# Altium schematic sheet EMG sensors.SchDoc
size 297 x 209 mm
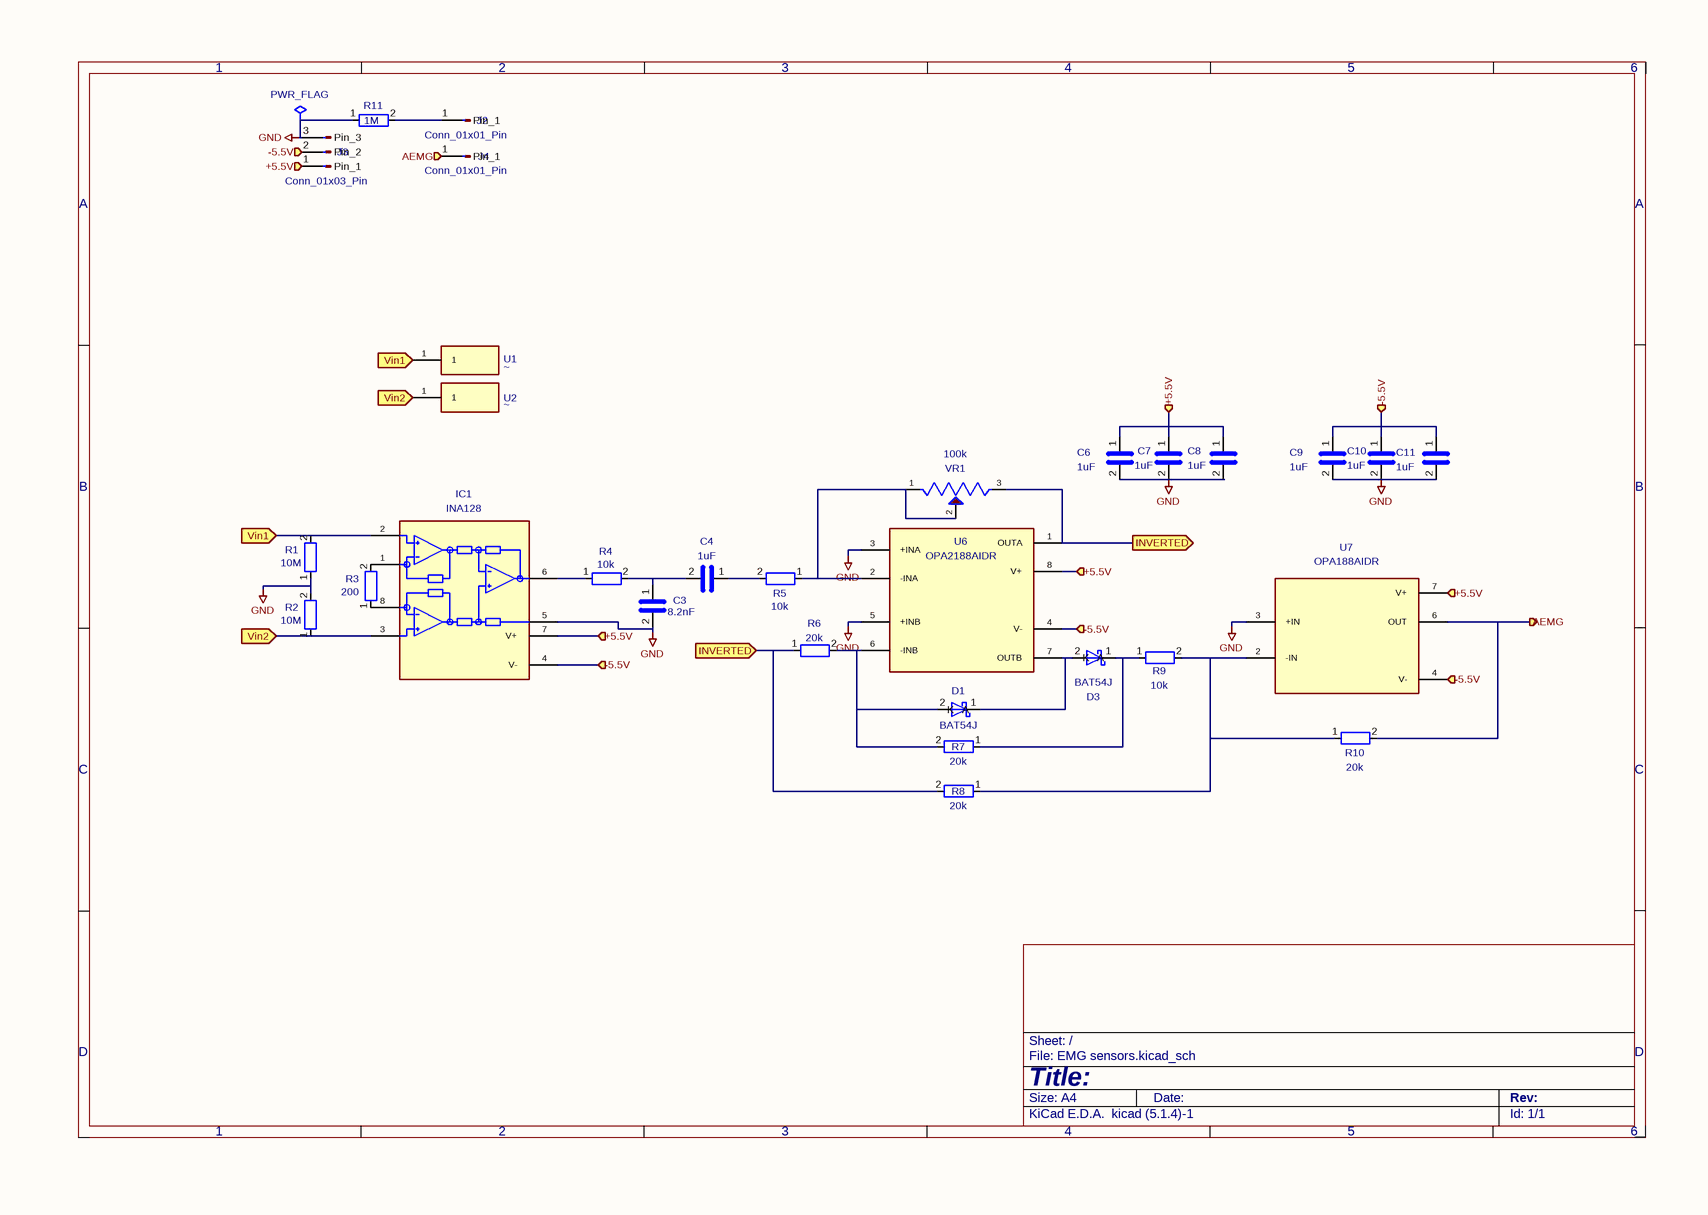
[diagram p0: EMG sensors.SchDoc]

## Parts
#FLG01  PWR_FLAG  (graphical)
C3  8.2nF  [C_0603_1608Metric_Pad1.08x0.95mm_HandSolder]
C4  1uF  [C_0603_1608Metric_Pad1.08x0.95mm_HandSolder]
C6  1uF  [C_0603_1608Metric_Pad1.08x0.95mm_HandSolder]
C7  1uF  [C_0603_1608Metric_Pad1.08x0.95mm_HandSolder]
C8  1uF  [C_0603_1608Metric_Pad1.08x0.95mm_HandSolder]
C9  1uF  [C_0603_1608Metric_Pad1.08x0.95mm_HandSolder]
C10  1uF  [C_0603_1608Metric_Pad1.08x0.95mm_HandSolder]
C11  1uF  [C_0603_1608Metric_Pad1.08x0.95mm_HandSolder]
D1  BAT54J  [D_SOD-323F]
D3  BAT54J  [D_SOD-323F]
IC1  INA128  [INA128U]
J2  Conn_01x01_Pin  [DIN_Male_1PIN_1.5mm]
J3  Conn_01x03_Pin  [JST_GH_SM03B-GHS-TB_1x03-1MP_P1.25mm_Horizontal]
J4  Conn_01x01_Pin  [DIN_Male_1PIN_1.5mm]
R1  10M  [R_0603_1608Metric_Pad0.98x0.95mm_HandSolder]
R2  10M  [R_0603_1608Metric_Pad0.98x0.95mm_HandSolder]
R3  200  [R_0603_1608Metric_Pad0.98x0.95mm_HandSolder]
R4  10k  [R_0603_1608Metric_Pad0.98x0.95mm_HandSolder]
R5  10k  [R_0603_1608Metric_Pad0.98x0.95mm_HandSolder]
R6  20k  [R_0603_1608Metric_Pad0.98x0.95mm_HandSolder]
R7  20k  [R_0603_1608Metric_Pad0.98x0.95mm_HandSolder]
R8  20k  [R_0603_1608Metric_Pad0.98x0.95mm_HandSolder]
R9  10k  [R_0603_1608Metric_Pad0.98x0.95mm_HandSolder]
R10  20k  [R_0603_1608Metric_Pad0.98x0.95mm_HandSolder]
R11  1M  [R_0603_1608Metric_Pad0.98x0.95mm_HandSolder]
U1  ~  [EMG_Snap_4mm]
U2  ~  [EMG_Snap_4mm]
U6  OPA2188AIDR  [ОПА2188AIDR]
U7  OPA188AIDR  [OPA188]
VR1  100k  [TRIM_3296W-1-104ALF]

## Ports
+5.5V (in), +5.5V (out), -5.5V (in), -5.5V (out), AEMG (in), AEMG (out), INVERTED (in), INVERTED (out), Vin1 (in), Vin1 (out), Vin2 (in), Vin2 (out)

## Nets
GND: #FLG01.1 C3.2 C6.2 C7.2 C8.2 C9.2 C10.2 C11.2 IC1.5 J3.3(Pin_3) R1.1 R2.2 R11.1 U6.3(+INA) U6.5(+INB) U7.3(+IN)
+5.5V: C6.1 C7.1 C8.1 IC1.7(V+) J3.1(Pin_1) U6.8(V+) U7.7(V+) ; port +5.5V
-5.5V: C9.1 C10.1 C11.1 IC1.4(V-) J3.2(Pin_2) U6.4(V-) U7.4(V-) ; port -5.5V
AEMG: J4.1(Pin_1) R10.2 U7.6(OUT) ; port AEMG
INVERTED: R6.1 R8.2 U6.1(OUTA) VR1.3 ; port INVERTED
Vin1: IC1.2 R1.2 U1.1 ; port Vin1
Vin2: IC1.3 R2.1 U2.1 ; port Vin2
NetC3_1: C3.1 C4.2 R4.2
NetC4_1: C4.1 R5.2
NetD1_1: D1.1(K) D3.2(A) U6.7(OUTB)
NetD1_2: D1.2(A) R6.2 R7.2 U6.6(-INB)
NetD3_1: D3.1(K) R7.1 R9.1
NetIC1_1: IC1.1 R3.2
NetIC1_6: IC1.6 R4.1
NetIC1_8: IC1.8 R3.1
NetJ2_1: J2.1(Pin_1) R11.2
NetR5_1: R5.1 U6.2(-INA) VR1.1 VR1.2
NetR8_1: R8.1 R9.2 R10.1 U7.2(-IN)

## Notes on the sheet
- 1
- 2
- 3
- 4
- 5
- 6
- A
- B
- C
- D
- Title:
- File: EMG sensors.kicad_sch
- Sheet: /
- KiCad E.D.A.  kicad (5.1.4)-1
- Size: A4
- Date:
- Rev:
- Id: 1/1

## Library data of the parts
#FLG01 = PWR_FLAG: Description: Special symbol for telling ERC where power comes from; Value: PWR_FLAG
C3 C4 C6-C11 = C: Description: Unpolarized capacitor; Footprint: Capacitor_SMD:C_0603_1608Metric_Pad1.08x0.95mm_HandSolder
  C3: Website: https://eu.mouser.com/ProductDetail/KEMET/C0603X822F5JACTU?qs=rKqJIm0tnYHyDiSLXoAHvg%3D%3D; Value: 8.2nF
  C4 C6-C11: Website: https://www.digikey.in/en/products/detail/kyocera-avx/KGM15BR71H104JT/1600043; Value: 1uF
D1 D3 = BAT54J: Description: 30V 200mA Schottky diode, SOD-323F; Value: BAT54J; Footprint: Diode_SMD:D_SOD-323F
IC1 = INA128: MF: Texas Instruments; Description_1: \n                        \n                            Instrumentation Amplifier 1 Circuit - 8-PDIP\n                        \n; Package: DIP-8 Rochester Electronics, LLC; MPN: INA128U; Price: None; OC_FARNELL: 1212413; SnapEDA_Link: https://www.snapeda.com/parts/INA128/Texas+Instruments/view-part/?ref=snap; MP: INA128; OC_NEWARK: 35C1729; Availability: Not in stock; Check_prices: https://www.snapeda.com/parts/INA128/Texas+Instruments/view-part/?ref=eda; Value: INA128; Footprint: OP AMPS:INA128U
J2 J4 = Conn_01x01_Pin: Description: Generic connector, single row, 01x01, script generated; Value: Conn_01x01_Pin; Footprint: Connectors:DIN_Male_1PIN_1.5mm
J3 = Conn_01x03_Pin: Description: Generic connector, single row, 01x03, script generated; Value: Conn_01x03_Pin; Footprint: Connector_JST:JST_GH_SM03B-GHS-TB_1x03-1MP_P1.25mm_Horizontal
R1-R11 = R: Description: Resistor; Footprint: Resistor_SMD:R_0603_1608Metric_Pad0.98x0.95mm_HandSolder
  R1 R2: Website: https://eu.mouser.com/ProductDetail/TE-Connectivity-Holsworthy/RT73F1J200RBTD?qs=sGAEpiMZZMvdGkrng054txLI%2FDB4oIKDBdRkx0ZmGeiYIoSkg5JMIw%3D%3D; Value: 10M
  R3: Website: https://eu.mouser.com/ProductDetail/TE-Connectivity-Holsworthy/RT73F1J200RBTD?qs=sGAEpiMZZMvdGkrng054txLI%2FDB4oIKDBdRkx0ZmGeiYIoSkg5JMIw%3D%3D; Value: 200
  R4 R5 R9: Value: 10k
  R6-R8 R10: Value: 20k
  R11: Value: 1M
U1 U2 = H_1: Value: ~; Footprint: EMG:EMG_Snap_4mm
U6 = OPA2188AIDR: MF: Texas Instruments; Description_1: \n                        \n                            0.03µV/°C, 6µV Vos, Low Noise, Rail-to-Rail Output, 36V Zero-Drift Operational Amplifier\n                        \n; Package: SOIC-8 Texas Instruments; Price: None; SnapEDA_Link: https://www.snapeda.com/parts/OPA2188AIDR/Texas+Instruments/view-part/?ref=snap; MP: OPA2188AIDR; Availability: In Stock; Check_prices: https://www.snapeda.com/parts/OPA2188AIDR/Texas+Instruments/view-part/?ref=eda; Value: OPA2188AIDR; Footprint: OP AMPS:ОПА2188AIDR
U7 = OPA188AIDR: MF: Texas Instruments; Description_1: \n                        \n                            Precision, Low-Noise, Rail-to-Rail Output, 36V Zero-Drift Operational Amplifier\n                        \n; Package: SOIC-8 Texas Instruments; Price: None; SnapEDA_Link: https://www.snapeda.com/parts/OPA188AIDR/Texas+Instruments/view-part/?ref=snap; MP: OPA188AIDR; Availability: In Stock; Check_prices: https://www.snapeda.com/parts/OPA188AIDR/Texas+Instruments/view-part/?ref=eda; Value: OPA188AIDR; Footprint: OP AMPS:OPA188
VR1 = 3296W-1-104ALF: MF: Bourns; Description_1: \n                        \n                            TRIMMER - 3/8in SQ MT CERMET | Bourns 3296W-1-104ALF\n                        \n; Package: NON STANDARD-3 Bourns; Price: None; Check_prices: https://www.snapeda.com/parts/3296W-1-104ALF/Bourns/view-part/?ref=eda; STANDARD: Manufacturer Recommendation; PARTREV: 05/16; SnapEDA_Link: https://www.snapeda.com/parts/3296W-1-104ALF/Bourns/view-part/?ref=snap; MP: 3296W-1-104ALF; Availability: In Stock; MANUFACTURER: Bourns; Value: 100k; Footprint: Trimmers:TRIM_3296W-1-104ALF